# EasyEDA schematic sch.json

## Sheets
1 Sheet_1: TITLE: Switches; REV: 1.0; Date: 2024-04-09; Sheet: 2/2; Drawn By: shubhmitsharma; Company: N/A
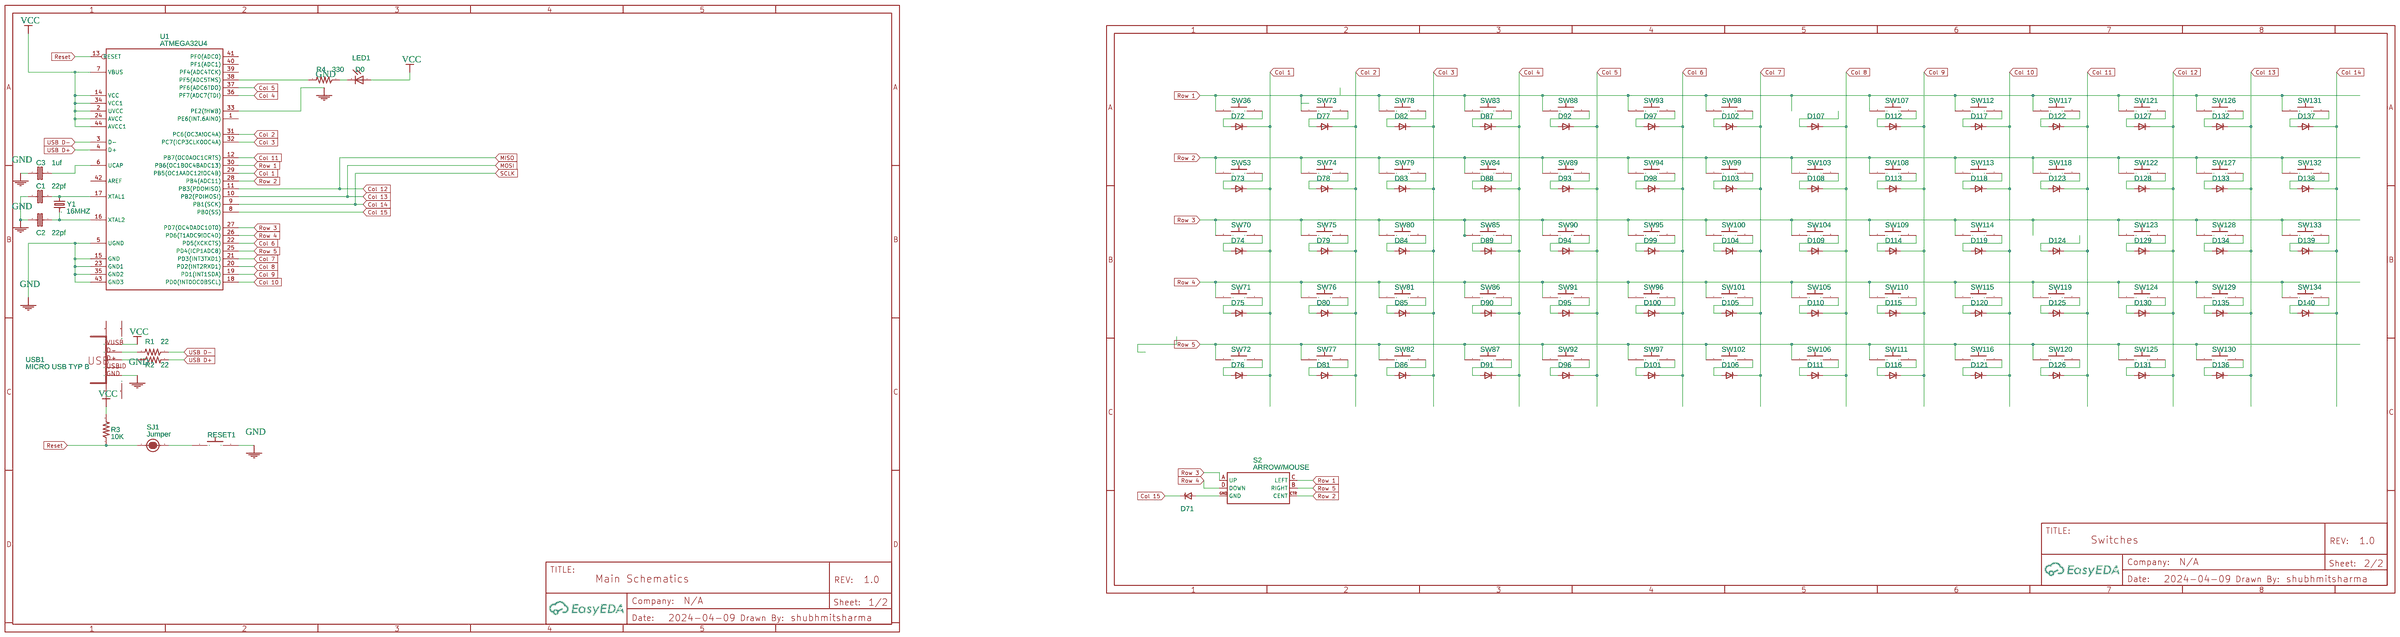
[diagram p0: Sheet_1]
2 Sheet_1#2
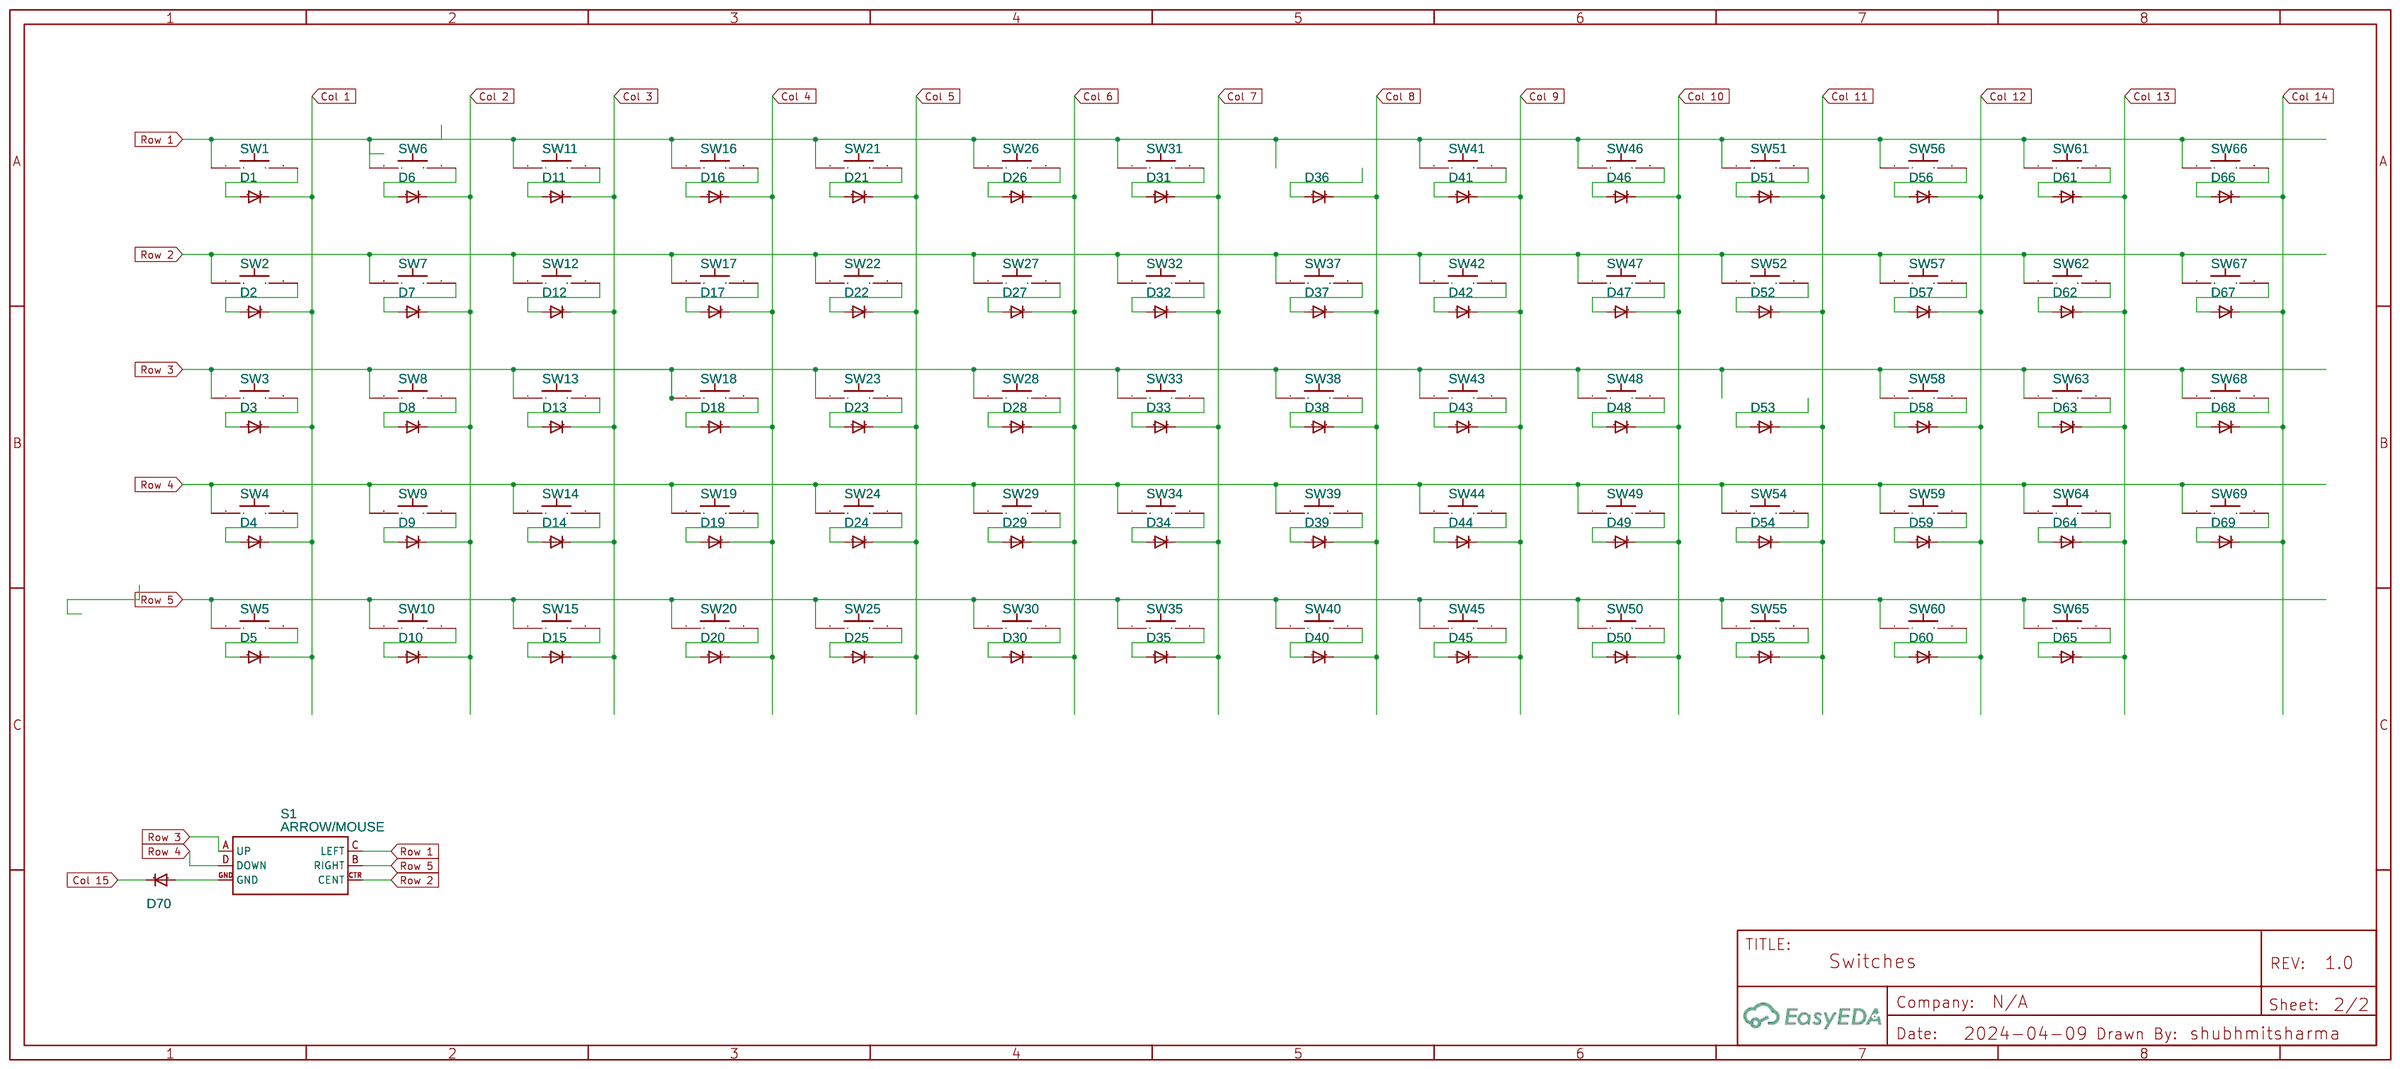
[diagram p1: Sheet_1#2]

## Parts
sheet Sheet_1#2
D1  NO  [SOD323F]
D2  NO  [SOD323F]
D3  NO  [SOD323F]
D4  NO  [SOD323F]
D5  NO  [SOD323F]
D6  NO  [SOD323F]
D7  NO  [SOD323F]
D8  NO  [SOD323F]
D9  NO  [SOD323F]
D10  NO  [SOD323F]
D11  NO  [SOD323F]
D12  NO  [SOD323F]
D13  NO  [SOD323F]
D14  NO  [SOD323F]
D15  NO  [SOD323F]
D16  NO  [SOD323F]
D17  NO  [SOD323F]
D18  NO  [SOD323F]
D19  NO  [SOD323F]
D20  NO  [SOD323F]
D21  NO  [SOD323F]
D22  NO  [SOD323F]
D23  NO  [SOD323F]
D24  NO  [SOD323F]
D25  NO  [SOD323F]
D26  NO  [SOD323F]
D27  NO  [SOD323F]
D28  NO  [SOD323F]
D29  NO  [SOD323F]
D30  NO  [SOD323F]
D31  NO  [SOD323F]
D32  NO  [SOD323F]
D33  NO  [SOD323F]
D34  NO  [SOD323F]
D35  NO  [SOD323F]
D36  NO  [SOD323F]
D37  NO  [SOD323F]
D38  NO  [SOD323F]
D39  NO  [SOD323F]
D40  NO  [SOD323F]
D41  NO  [SOD323F]
D42  NO  [SOD323F]
D43  NO  [SOD323F]
D44  NO  [SOD323F]
D45  NO  [SOD323F]
D46  NO  [SOD323F]
D47  NO  [SOD323F]
D48  NO  [SOD323F]
D49  NO  [SOD323F]
D50  NO  [SOD323F]
D51  NO  [SOD323F]
D52  NO  [SOD323F]
D53  NO  [SOD323F]
D54  NO  [SOD323F]
D55  NO  [SOD323F]
D56  NO  [SOD323F]
D57  NO  [SOD323F]
D58  NO  [SOD323F]
D59  NO  [SOD323F]
D60  NO  [SOD323F]
D61  NO  [SOD323F]
D62  NO  [SOD323F]
D63  NO  [SOD323F]
D64  NO  [SOD323F]
D65  NO  [SOD323F]
D66  NO  [SOD323F]
D67  NO  [SOD323F]
D68  NO  [SOD323F]
D69  NO  [SOD323F]
D70  NO  [SOD323F]
S1  ARROW/MOUSE  [JOYSTICK_MINI]
SW1  NO  [TL3303]
SW2  NO  [TL3303]
SW3  NO  [TL3303]
SW4  NO  [TL3303]
SW5  NO  [TL3303]
SW6  NO  [TL3303]
SW7  NO  [TL3303]
SW8  NO  [TL3303]
SW9  NO  [TL3303]
SW10  NO  [TL3303]
SW11  NO  [TL3303]
SW12  NO  [TL3303]
SW13  NO  [TL3303]
SW14  NO  [TL3303]
SW15  NO  [TL3303]
SW16  NO  [TL3303]
SW17  NO  [TL3303]
SW18  NO  [TL3303]
SW19  NO  [TL3303]
SW20  NO  [TL3303]
SW21  NO  [TL3303]
SW22  NO  [TL3303]
SW23  NO  [TL3303]
SW24  NO  [TL3303]
SW25  NO  [TL3303]
SW26  NO  [TL3303]
SW27  NO  [TL3303]
SW28  NO  [TL3303]
SW29  NO  [TL3303]
SW30  NO  [TL3303]
SW31  NO  [TL3303]
SW32  NO  [TL3303]
SW33  NO  [TL3303]
SW34  NO  [TL3303]
SW35  NO  [TL3303]
SW37  NO  [TL3303]
SW38  NO  [TL3303]
SW39  NO  [TL3303]
SW40  NO  [TL3303]
SW41  NO  [TL3303]
SW42  NO  [TL3303]
SW43  NO  [TL3303]
SW44  NO  [TL3303]
SW45  NO  [TL3303]
SW46  NO  [TL3303]
SW47  NO  [TL3303]
SW48  NO  [TL3303]
SW49  NO  [TL3303]
SW50  NO  [TL3303]
SW51  NO  [TL3303]
SW52  NO  [TL3303]
SW54  NO  [TL3303]
SW55  NO  [TL3303]
SW56  NO  [TL3303]
SW57  NO  [TL3303]
SW58  NO  [TL3303]
SW59  NO  [TL3303]
SW60  NO  [TL3303]
SW61  NO  [TL3303]
SW62  NO  [TL3303]
SW63  NO  [TL3303]
SW64  NO  [TL3303]
SW65  NO  [TL3303]
SW66  NO  [TL3303]
SW67  NO  [TL3303]
SW68  NO  [TL3303]
SW69  NO  [TL3303]
sheet Sheet_1
C1  22pf  [C805]
C2  22pf  [C805]
C3  1uf  [C805]
D71  NO  [SOD323F]
D72  NO  [SOD323F]
D73  NO  [SOD323F]
D74  NO  [SOD323F]
D75  NO  [SOD323F]
D76  NO  [SOD323F]
D77  NO  [SOD323F]
D78  NO  [SOD323F]
D79  NO  [SOD323F]
D80  NO  [SOD323F]
D81  NO  [SOD323F]
D82  NO  [SOD323F]
D83  NO  [SOD323F]
D84  NO  [SOD323F]
D85  NO  [SOD323F]
D86  NO  [SOD323F]
D87  NO  [SOD323F]
D88  NO  [SOD323F]
D89  NO  [SOD323F]
D90  NO  [SOD323F]
D91  NO  [SOD323F]
D92  NO  [SOD323F]
D93  NO  [SOD323F]
D94  NO  [SOD323F]
D95  NO  [SOD323F]
D96  NO  [SOD323F]
D97  NO  [SOD323F]
D98  NO  [SOD323F]
D99  NO  [SOD323F]
D100  NO  [SOD323F]
D101  NO  [SOD323F]
D102  NO  [SOD323F]
D103  NO  [SOD323F]
D104  NO  [SOD323F]
D105  NO  [SOD323F]
D106  NO  [SOD323F]
D107  NO  [SOD323F]
D108  NO  [SOD323F]
D109  NO  [SOD323F]
D110  NO  [SOD323F]
D111  NO  [SOD323F]
D112  NO  [SOD323F]
D113  NO  [SOD323F]
D114  NO  [SOD323F]
D115  NO  [SOD323F]
D116  NO  [SOD323F]
D117  NO  [SOD323F]
D118  NO  [SOD323F]
D119  NO  [SOD323F]
D120  NO  [SOD323F]
D121  NO  [SOD323F]
D122  NO  [SOD323F]
D123  NO  [SOD323F]
D124  NO  [SOD323F]
D125  NO  [SOD323F]
D126  NO  [SOD323F]
D127  NO  [SOD323F]
D128  NO  [SOD323F]
D129  NO  [SOD323F]
D130  NO  [SOD323F]
D131  NO  [SOD323F]
D132  NO  [SOD323F]
D133  NO  [SOD323F]
D134  NO  [SOD323F]
D135  NO  [SOD323F]
D136  NO  [SOD323F]
D137  NO  [SOD323F]
D138  NO  [SOD323F]
D139  NO  [SOD323F]
D140  NO  [SOD323F]
LED1  D0  [CHIPLED_0805]
R1  22  [0805]
R2  22  [0805]
R3  10K  [0805]
R4  330  [0805]
RESET1  NO  [TL3303]
S2  ARROW/MOUSE  [JOYSTICK_MINI]
SJ1  Jumper  [PAD-JUMPER-2-NC_BY_PASTE_YES_SILK]
SW36  NO  [TL3303]
SW53  NO  [TL3303]
SW70  NO  [TL3303]
SW71  NO  [TL3303]
SW72  NO  [TL3303]
SW73  NO  [TL3303]
SW74  NO  [TL3303]
SW75  NO  [TL3303]
SW76  NO  [TL3303]
SW77  NO  [TL3303]
SW78  NO  [TL3303]
SW79  NO  [TL3303]
SW80  NO  [TL3303]
SW81  NO  [TL3303]
SW82  NO  [TL3303]
SW83  NO  [TL3303]
SW84  NO  [TL3303]
SW85  NO  [TL3303]
SW86  NO  [TL3303]
SW87  NO  [TL3303]
SW88  NO  [TL3303]
SW89  NO  [TL3303]
SW90  NO  [TL3303]
SW91  NO  [TL3303]
SW92  NO  [TL3303]
SW93  NO  [TL3303]
SW94  NO  [TL3303]
SW95  NO  [TL3303]
SW96  NO  [TL3303]
SW97  NO  [TL3303]
SW98  NO  [TL3303]
SW99  NO  [TL3303]
SW100  NO  [TL3303]
SW101  NO  [TL3303]
SW102  NO  [TL3303]
SW103  NO  [TL3303]
SW104  NO  [TL3303]
SW105  NO  [TL3303]
SW106  NO  [TL3303]
SW107  NO  [TL3303]
SW108  NO  [TL3303]
SW109  NO  [TL3303]
SW110  NO  [TL3303]
SW111  NO  [TL3303]
SW112  NO  [TL3303]
SW113  NO  [TL3303]
SW114  NO  [TL3303]
SW115  NO  [TL3303]
SW116  NO  [TL3303]
SW117  NO  [TL3303]
SW118  NO  [TL3303]
SW119  NO  [TL3303]
SW120  NO  [TL3303]
SW121  NO  [TL3303]
SW122  NO  [TL3303]
SW123  NO  [TL3303]
SW124  NO  [TL3303]
SW125  NO  [TL3303]
SW126  NO  [TL3303]
SW127  NO  [TL3303]
SW128  NO  [TL3303]
SW129  NO  [TL3303]
SW130  NO  [TL3303]
SW131  NO  [TL3303]
SW132  NO  [TL3303]
SW133  NO  [TL3303]
SW134  NO  [TL3303]
U1  ATMEGA32U4  [TQFP44]
USB1  MICRO USB TYP B  [CONN_USB_MICRO-B]
Y1  16MHZ  [CRYSTAL-SMD-5X3]

## Library data of the parts
D1-D140 = -: catid: 20; Manufacturer Part: ?
S1 S2 = -: Small 5-way tactile joystick, COM-10063; catid: 20; Contributor: SparkFun; Manufacturer Part: ?
RESET1 SW1-SW134 = -: Contributor: wrieden; sourceId: TnvoiYuoG; Manufacturer Part: ?
C1-C3 = -: Non-Polarized capacitor in various packages; catid: 20; Contributor: DangerousPrototype; Manufacturer Part: ?
LED1 U1 = -: catid: 20; Contributor: Adafruit; Manufacturer Part: ?
R1-R4 SJ1 Y1 = -: catid: 20; Contributor: SparkFun; Manufacturer Part: ?
USB1 = -: USB Female connector; catid: 20; Contributor: DangerousPrototype; sourceId: I1dbL75qo; Manufacturer Part: ?

## Nets
GND: C1.1 C2.2 C3.1 RESET1.2 U1.5(UGND) U1.15(GND) U1.23(GND1) U1.33(PE2(!HWB)) U1.35(GND2) U1.43(GND3) USB1.P5(GND)
VCC: LED1.A R3.2 U1.2(UVCC) U1.7(VBUS) U1.14(VCC) U1.24(AVCC) U1.34(VCC1) U1.44(AVCC1) USB1.P1(VUSB)
Col 1: D1.C D2.C D3.C D4.C D5.C D72.C D73.C D74.C D75.C D76.C U1.29(PB5(OC1AADC12!OC4B))
Col 2: D6.C D7.C D8.C D9.C D10.C D77.C D78.C D79.C D80.C D81.C U1.31(PC6(OC3A!OC4A))
Col 3: D11.C D12.C D13.C D14.C D15.C D82.C D83.C D84.C D85.C D86.C U1.32(PC7(ICP3CLK0OC4A))
Col 4: D16.C D17.C D18.C D19.C D20.C D87.C D88.C D89.C D90.C D91.C U1.36(PF7(ADC7(TDI))
Col 5: D21.C D22.C D23.C D24.C D25.C D92.C D93.C D94.C D95.C D96.C U1.37(PF6(ADC6TDO))
Col 6: D26.C D27.C D28.C D29.C D30.C D97.C D98.C D99.C D100.C D101.C U1.22(PD5(XCKCTS))
Col 7: D31.C D32.C D33.C D34.C D35.C D102.C D103.C D104.C D105.C D106.C U1.21(PD3(INT3TXD1))
Col 8: D36.C D37.C D38.C D39.C D40.C D107.C D108.C D109.C D110.C D111.C U1.20(PD2(INT2RXD1))
Col 9: D41.C D42.C D43.C D44.C D45.C D112.C D113.C D114.C D115.C D116.C U1.19(PD1(INT1SDA))
Col 10: D46.C D47.C D48.C D49.C D50.C D117.C D118.C D119.C D120.C D121.C U1.18(PD0(INT0OC0BSCL))
Col 11: D51.C D52.C D53.C D54.C D55.C D122.C D123.C D124.C D125.C D126.C U1.12(PB7(OC0AOC1CRTS))
Col 12: D56.C D57.C D58.C D59.C D60.C D127.C D128.C D129.C D130.C D131.C U1.11(PB3(PDOMISO))
Col 13: D61.C D62.C D63.C D64.C D65.C D132.C D133.C D134.C D135.C D136.C U1.10(PB2(PDIMOSI))
Col 14: D66.C D67.C D68.C D69.C D137.C D138.C D139.C D140.C U1.9(PB1(SCK))
Col 15: D70.C D71.C U1.8(PB0(SS))
Reset: R3.1 SJ1.1 U1.13(RESET)
Row 1: S1.C(LEFT) S2.C(LEFT) SW1.1 SW6.1 SW11.1 SW16.1 SW21.1 SW26.1 SW31.1 SW36.1 SW41.1 SW46.1 SW51.1 SW56.1 SW61.1 SW66.1 SW73.1 SW78.1 SW83.1 SW88.1 SW93.1 SW98.1 SW107.1 SW112.1 SW117.1 SW121.1 SW126.1 SW131.1 U1.30(PB6(OC1BOC4BADC13))
Row 2: S1.CTR(CENT) S2.CTR(CENT) SW2.1 SW7.1 SW12.1 SW17.1 SW22.1 SW27.1 SW32.1 SW37.1 SW42.1 SW47.1 SW52.1 SW53.1 SW57.1 SW62.1 SW67.1 SW74.1 SW79.1 SW84.1 SW89.1 SW94.1 SW99.1 SW103.1 SW108.1 SW113.1 SW118.1 SW122.1 SW127.1 SW132.1 U1.28(PB4(ADC11))
Row 3: S1.A(UP) S2.A(UP) SW3.1 SW8.1 SW13.1 SW18.1 SW23.1 SW28.1 SW33.1 SW38.1 SW43.1 SW48.1 SW58.1 SW63.1 SW68.1 SW70.1 SW75.1 SW80.1 SW85.1 SW90.1 SW95.1 SW100.1 SW104.1 SW109.1 SW114.1 SW123.1 SW128.1 SW133.1 U1.27(PD7(OC4DADC10T0))
Row 4: S1.D(DOWN) S2.D(DOWN) SW4.1 SW9.1 SW14.1 SW19.1 SW24.1 SW29.1 SW34.1 SW39.1 SW44.1 SW49.1 SW54.1 SW59.1 SW64.1 SW69.1 SW71.1 SW76.1 SW81.1 SW86.1 SW91.1 SW96.1 SW101.1 SW105.1 SW110.1 SW115.1 SW119.1 SW124.1 SW129.1 SW134.1 U1.26(PD6(T1ADC9!OC4D))
Row 5: S1.B(RIGHT) S2.B(RIGHT) SW5.1 SW10.1 SW15.1 SW20.1 SW25.1 SW30.1 SW35.1 SW40.1 SW45.1 SW50.1 SW55.1 SW60.1 SW65.1 SW72.1 SW77.1 SW82.1 SW87.1 SW92.1 SW97.1 SW102.1 SW106.1 SW111.1 SW116.1 SW120.1 SW125.1 SW130.1 U1.25(PD4(ICP1ADC8))
USB D+: R2.2 U1.4(D+)
USB D-: R1.1 U1.3(D-)
Net-(C1-2): C1.2 U1.17(XTAL1) Y1.1
Net-(C2-1): C2.1 U1.16(XTAL2) Y1.3(2)
Net-(C3-2): C3.2 U1.6(UCAP)
Net-(D1-A): D1.A SW1.2
Net-(D2-A): D2.A SW2.2
Net-(D3-A): D3.A SW3.2
Net-(D4-A): D4.A SW4.2
Net-(D5-A): D5.A SW5.2
Net-(D6-A): D6.A SW6.2
Net-(D7-A): D7.A SW7.2
Net-(D8-A): D8.A SW8.2
Net-(D9-A): D9.A SW9.2
Net-(D10-A): D10.A SW10.2
Net-(D11-A): D11.A SW11.2
Net-(D12-A): D12.A SW12.2
Net-(D13-A): D13.A SW13.2
Net-(D14-A): D14.A SW14.2
Net-(D15-A): D15.A SW15.2
Net-(D16-A): D16.A SW16.2
Net-(D17-A): D17.A SW17.2
Net-(D18-A): D18.A SW18.2
Net-(D19-A): D19.A SW19.2
Net-(D20-A): D20.A SW20.2
Net-(D21-A): D21.A SW21.2
Net-(D22-A): D22.A SW22.2
Net-(D23-A): D23.A SW23.2
Net-(D24-A): D24.A SW24.2
Net-(D25-A): D25.A SW25.2
Net-(D26-A): D26.A SW26.2
Net-(D27-A): D27.A SW27.2
Net-(D28-A): D28.A SW28.2
Net-(D29-A): D29.A SW29.2
Net-(D30-A): D30.A SW30.2
Net-(D31-A): D31.A SW31.2
Net-(D32-A): D32.A SW32.2
Net-(D33-A): D33.A SW33.2
Net-(D34-A): D34.A SW34.2
Net-(D35-A): D35.A SW35.2
Net-(D37-A): D37.A SW37.2
Net-(D38-A): D38.A SW38.2
Net-(D39-A): D39.A SW39.2
Net-(D40-A): D40.A SW40.2
Net-(D41-A): D41.A SW41.2
Net-(D42-A): D42.A SW42.2
Net-(D43-A): D43.A SW43.2
Net-(D44-A): D44.A SW44.2
Net-(D45-A): D45.A SW45.2
Net-(D46-A): D46.A SW46.2
Net-(D47-A): D47.A SW47.2
Net-(D48-A): D48.A SW48.2
Net-(D49-A): D49.A SW49.2
Net-(D50-A): D50.A SW50.2
Net-(D51-A): D51.A SW51.2
Net-(D52-A): D52.A SW52.2
Net-(D54-A): D54.A SW54.2
Net-(D55-A): D55.A SW55.2
Net-(D56-A): D56.A SW56.2
Net-(D57-A): D57.A SW57.2
Net-(D58-A): D58.A SW58.2
Net-(D59-A): D59.A SW59.2
Net-(D60-A): D60.A SW60.2
Net-(D61-A): D61.A SW61.2
Net-(D62-A): D62.A SW62.2
Net-(D63-A): D63.A SW63.2
Net-(D64-A): D64.A SW64.2
Net-(D65-A): D65.A SW65.2
Net-(D66-A): D66.A SW66.2
Net-(D67-A): D67.A SW67.2
Net-(D68-A): D68.A SW68.2
Net-(D69-A): D69.A SW69.2
Net-(D70-A): D70.A S1.GND
Net-(D71-A): D71.A S2.GND
Net-(D72-A): D72.A SW36.2
Net-(D73-A): D73.A SW53.2
Net-(D74-A): D74.A SW70.2
Net-(D75-A): D75.A SW71.2
Net-(D76-A): D76.A SW72.2
Net-(D77-A): D77.A SW73.2
Net-(D78-A): D78.A SW74.2
Net-(D79-A): D79.A SW75.2
Net-(D80-A): D80.A SW76.2
Net-(D81-A): D81.A SW77.2
Net-(D82-A): D82.A SW78.2
Net-(D83-A): D83.A SW79.2
Net-(D84-A): D84.A SW80.2
Net-(D85-A): D85.A SW81.2
Net-(D86-A): D86.A SW82.2
Net-(D87-A): D87.A SW83.2
Net-(D88-A): D88.A SW84.2
Net-(D89-A): D89.A SW85.2
Net-(D90-A): D90.A SW86.2
Net-(D91-A): D91.A SW87.2
Net-(D92-A): D92.A SW88.2
Net-(D93-A): D93.A SW89.2
Net-(D94-A): D94.A SW90.2
Net-(D95-A): D95.A SW91.2
Net-(D96-A): D96.A SW92.2
Net-(D97-A): D97.A SW93.2
Net-(D98-A): D98.A SW94.2
Net-(D99-A): D99.A SW95.2
Net-(D100-A): D100.A SW96.2
Net-(D101-A): D101.A SW97.2
Net-(D102-A): D102.A SW98.2
Net-(D103-A): D103.A SW99.2
Net-(D104-A): D104.A SW100.2
Net-(D105-A): D105.A SW101.2
Net-(D106-A): D106.A SW102.2
Net-(D108-A): D108.A SW103.2
Net-(D109-A): D109.A SW104.2
Net-(D110-A): D110.A SW105.2
Net-(D111-A): D111.A SW106.2
Net-(D112-A): D112.A SW107.2
Net-(D113-A): D113.A SW108.2
Net-(D114-A): D114.A SW109.2
Net-(D115-A): D115.A SW110.2
Net-(D116-A): D116.A SW111.2
Net-(D117-A): D117.A SW112.2
Net-(D118-A): D118.A SW113.2
Net-(D119-A): D119.A SW114.2
Net-(D120-A): D120.A SW115.2
Net-(D121-A): D121.A SW116.2
Net-(D122-A): D122.A SW117.2
Net-(D123-A): D123.A SW118.2
Net-(D125-A): D125.A SW119.2
Net-(D126-A): D126.A SW120.2
Net-(D127-A): D127.A SW121.2
Net-(D128-A): D128.A SW122.2
Net-(D129-A): D129.A SW123.2
Net-(D130-A): D130.A SW124.2
Net-(D131-A): D131.A SW125.2
Net-(D132-A): D132.A SW126.2
Net-(D133-A): D133.A SW127.2
Net-(D134-A): D134.A SW128.2
Net-(D135-A): D135.A SW129.2
Net-(D136-A): D136.A SW130.2
Net-(D137-A): D137.A SW131.2
Net-(D138-A): D138.A SW132.2
Net-(D139-A): D139.A SW133.2
Net-(D140-A): D140.A SW134.2
Net-(LED1-C): LED1.C R4.1
Net-(R1-2): R1.2 USB1.P2(D-)
Net-(R2-1): R2.1 USB1.P3(D+)
Net-(R4-2): R4.2 U1.38(PF5(ADC5TMS))
Net-(RESET1-1): RESET1.1 SJ1.2

Not connected (* = marked no-connect by the designer): D36 A; D53 A; D107 A; D124 A; U1 1(PE6(INT.6AIN0)) 39(PF4(ADC4TCK)) 40(PF1(ADC1)) 41(PF0(ADC0)) 42(AREF); USB1 BODY@1(BODY) BODY@2(BODY) BODY@3(BODY) BODY@4(BODY) P4(USBID)
